# EAGLE design Weight-X (EAGLE 7.6.0)
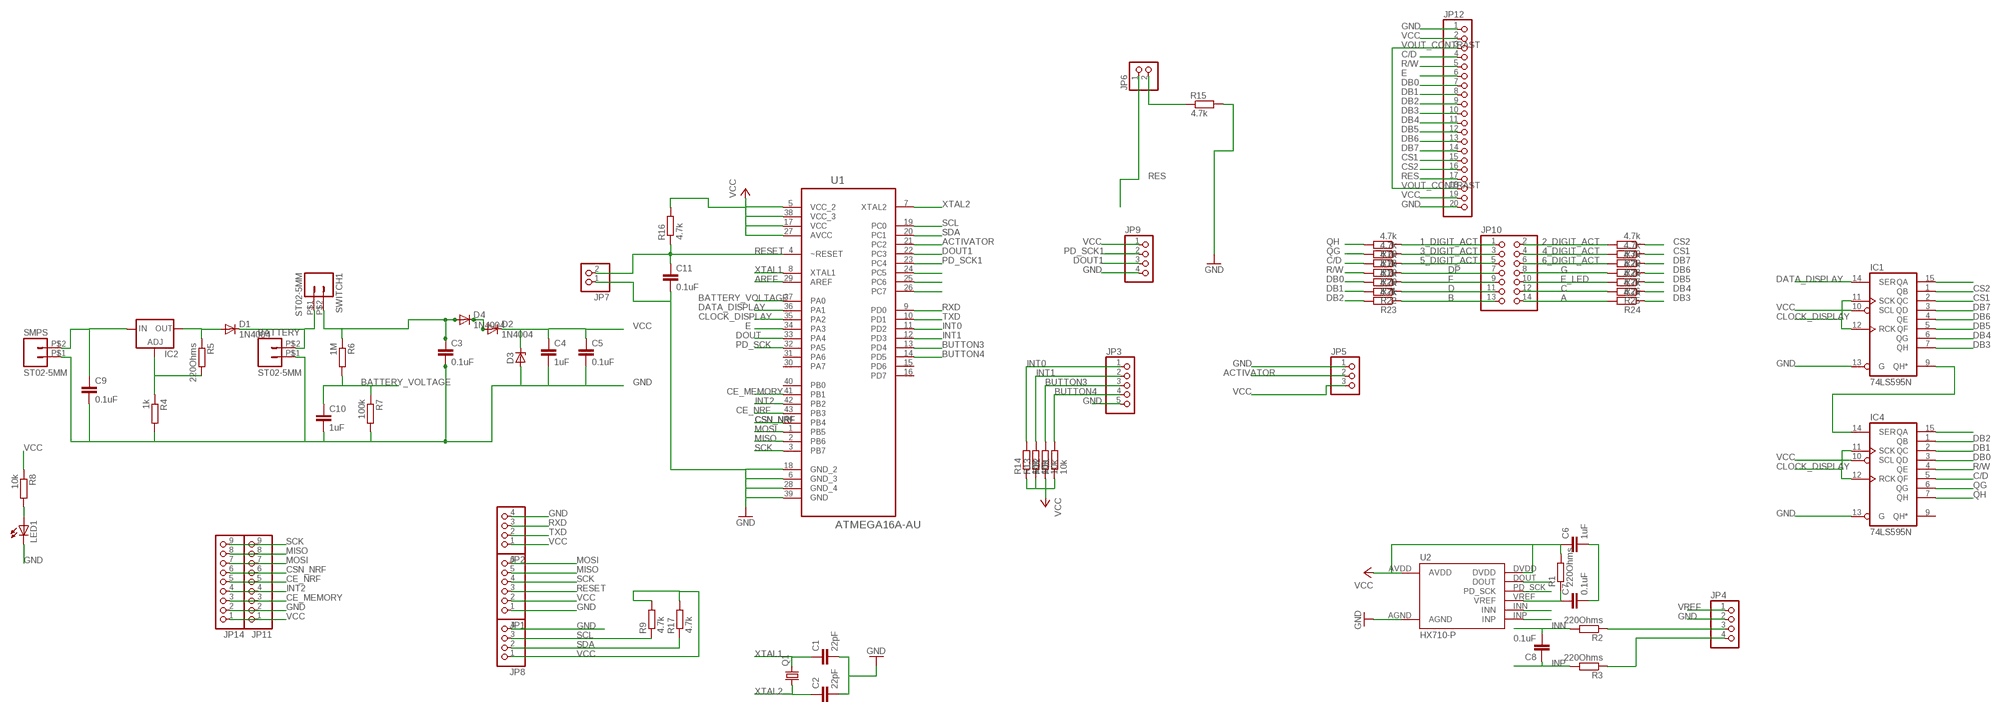
[diagram p0: schematic, sheet 1]

## Parts
BATTERY  ST02-5MM  [EK500V-02P]
C1  22pF  C2.5/2  [C2.5-2]
C2  22pF  C2.5/2  [C2.5-2]
C3  0.1uF  C5/2.5  [C5B2.5]
C4  1uF  C5/2.5  [C5B2.5]
C5  0.1uF  C5/2.5  [C5B2.5]
C6  1uF  C5/2.5  [C5B2.5]
C7  0.1uF  C5/2.5  [C5B2.5]
C8  0.1uF  C5/2.5  [C5B2.5]
C9  0.1uF  C5/2.5  [C5B2.5]
C10  1uF  C5/2.5  [C5B2.5]
C11  0.1uF  C5/2.5  [C5B2.5]
D1  1N4004  [DO41-10]
D2  1N4004  [DO41-10]
D3  ZENER-DIODEC1702-15  [C1702-15]
D4  1N4004  [DO41-10]
IC1  74LS595N  [DIL16]
IC2  LM317TS  [317TS]
IC4  74LS595N  [DIL16]
JP1  PINHD-1X6  [1X06]
JP2  PINHD-1X4  [1X04]
JP3  PINHD-1X5  [1X05]
JP4  PINHD-1X4  [1X04]
JP5  PINHD-1X3  [1X03]
JP6  PINHD-1X2  [1X02]
JP7  PINHD-1X2  [1X02]
JP8  PINHD-1X4  [1X04]
JP9  PINHD-1X4  [1X04]
JP10  PINHD-2X7  [2X07]
JP11  PINHD-1X9  [1X09]
JP12  PINHD-1X20  [1X20]
JP14  PINHD-1X9  [1X09]
LED1  LED5MM  [LED5MM]
Q1  CRYSTALHC49U-V  [HC49U-V]
R1  220Ohms  R0204/7  [0204/7]
R2  220Ohms  R0204/7  [0204/7]
R3  220Ohms  R0204/7  [0204/7]
R4  1k  R0204/7  [0204/7]
R5  220Ohms  R0204/7  [0204/7]
R6  1M  R0204/7  [0204/7]
R7  100k  R0204/7  [0204/7]
R8  10k  R0204/7  [0204/7]
R9  4.7k  R0204/7  [0204/7]
R10  4.7k  R0204/7  [0204/7]
R11  10k  R0204/7  [0204/7]
R12  10k  R0204/7  [0204/7]
R13  10k  R0204/7  [0204/7]
R14  10k  R0204/7  [0204/7]
R15  4.7k  R0204/7  [0204/7]
R16  4.7k  R0204/7  [0204/7]
R17  4.7k  R0204/7  [0204/7]
R18  4.7k  R0204/7  [0204/7]
R19  4.7k  R0204/7  [0204/7]
R20  4.7k  R0204/7  [0204/7]
R21  4.7k  R0204/7  [0204/7]
R22  4.7k  R0204/7  [0204/7]
R23  4.7k  R0204/7  [0204/7]
R24  4.7k  R0204/7  [0204/7]
R25  4.7k  R0204/7  [0204/7]
R26  4.7k  R0204/7  [0204/7]
R27  4.7k  R0204/7  [0204/7]
R28  4.7k  R0204/7  [0204/7]
R29  4.7k  R0204/7  [0204/7]
R30  4.7k  R0204/7  [0204/7]
SMPS  ST02-5MM  [EK500V-02P]
SWITCH1  ST02-5MM  [EK500V-02P]
U1  ATMEGA16A-AU  [QFP80P1200X1200X120-44N]
U2  HX710-P  [PDIP08_300MIL]

## Nets
1_DIGIT_ACT: JP10.1 R10.1
2_DIGIT_ACT: JP10.2 R30.2
3_DIGIT_ACT: JP10.3 R18.1
4_DIGIT_ACT: JP10.4 R29.2
5_DIGIT_ACT: JP10.5 R19.1
6_DIGIT_ACT: JP10.6 R28.2
A: JP10.14 R24.2
ACTIVATOR: JP5.2 U1.21(PC2)
AREF: U1.29(AREF)
B: JP10.13 R23.1
BATTERY_VOLTAGE: C10.1 R6.2 R7.1 U1.37(PA0)
BUTTON3: JP3.3 R12.2 U1.13(PD4)
BUTTON4: JP3.4 R11.2 U1.14(PD5)
C: JP10.12 R25.2
C/D: IC4.5(QF) JP12.4 R19.2
CE_MEMORY: JP11.3 JP14.3 U1.41(PB1)
CE_NRF: JP11.5 JP14.5 U1.43(PB3)
CLOCK_DISPLAY: IC1.11(SCK) IC1.12(RCK) IC4.11(SCK) IC4.12(RCK) U1.35(PA2)
CS1: IC1.2(QC) JP12.15 R29.1
CS2: IC1.1(QB) JP12.16 R30.1
CSN_NRF: JP11.6 JP14.6 U1.44(PB4)
D: JP10.11 R22.1
DATA_DISPLAY: IC1.14(SER) U1.36(PA1)
DB0: IC4.3(QD) JP12.7 R21.2
DB1: IC4.2(QC) JP12.8 R22.2
DB2: IC4.1(QB) JP12.9 R23.2
DB3: IC1.7(QH) JP12.10 R24.1
DB4: IC1.6(QG) JP12.11 R25.1
DB5: IC1.5(QF) JP12.12 R26.1
DB6: IC1.4(QE) JP12.13 R27.1
DB7: IC1.3(QD) JP12.14 R28.1
DOUT: U1.33(PA4) U2.DOUT
DOUT1: JP9.3 U1.22(PC3)
DP: JP10.7 R20.1
E: JP12.6 U1.34(PA3)
E_LED: JP10.10 R26.2
F: JP10.9 R21.1
G: JP10.8 R27.2
GND: BATTERY.P$1 C1.2 C2.2 C3.2 C4.2 C5.2 C6.2 C7.2 C9.2 C10.2 C11.2 D3.A IC1.13(G) IC4.13(G) JP1.1 JP2.4 JP3.5 JP4.2 JP5.1 JP7.1 JP8.4 JP9.4 JP11.2 JP12.1 JP12.20 JP14.2 LED1.K(C) R4.2 R7.2 R15.2 SMPS.P$1 U1.6(GND_3) U1.18(GND_2) U1.28(GND_4) U1.39(GND) U2.AGND
INN: C8.2 R2.2 U2.INN
INP: C8.1 R3.2 U2.INP
INT0: JP3.1 R14.2 U1.11(PD2)
INT1: JP3.2 R13.2 U1.12(PD3)
INT2: JP11.4 JP14.4 U1.42(PB2)
MISO: JP1.5 JP11.8 JP14.8 U1.2(PB6)
MOSI: JP1.6 JP11.7 JP14.7 U1.1(PB5)
N$1: BATTERY.P$2 D1.C SWITCH1.P$1
N$2: IC2.1(ADJ) R4.1 R5.2
N$3: LED1.A R8.2
N$4: D1.A IC2.2(OUT) R5.1
N$5: JP4.3 R2.1
N$6: D2.A D4.C
N$7: C9.1 IC2.3(IN) SMPS.P$2
N$10: C3.1 D4.A R6.1 SWITCH1.P$2
N$11: JP4.4 R3.1
N$13: JP6.2 R15.1
N$15: IC1.9(QH*) IC4.14(SER)
N$16: IC1.15(QA)
N$20: U1.24(PC5)
N$21: U1.25(PC6)
N$22: U1.26(PC7)
N$24: IC4.15(QA)
PD_SCK: U1.32(PA5) U2.PD_SCK
PD_SCK1: JP9.2 U1.23(PC4)
QG: IC4.6(QG) R18.2
QH: IC4.7(QH) R10.2
R/W: IC4.4(QE) JP12.5 R20.2
RES: JP6.1 JP12.17
RESET: C11.1 JP1.3 JP7.2 R16.1 U1.4(~RESET)
RXD: JP2.3 U1.9(PD0)
SCK: JP1.4 JP11.9 JP14.9 U1.3(PB7)
SCL: JP8.3 R9.1 U1.19(PC0)
SDA: JP8.2 R17.1 U1.20(PC1)
TXD: JP2.2 U1.10(PD1)
VCC: C4.1 C5.1 C6.1 D2.C D3.C IC1.10(SCL) IC4.10(SCL) JP1.2 JP2.1 JP5.3 JP8.1 JP9.1 JP11.1 JP12.2 JP12.19 JP14.1 R1.2 R8.1 R9.2 R11.1 R12.1 R13.1 R14.1 R16.2 R17.2 U1.5(VCC_2) U1.17(VCC) U1.27(AVCC) U1.38(VCC_3) U2.AVDD U2.DVDD
VOUT_CONTRAST: JP12.3 JP12.18
VREF: C7.1 JP4.1 R1.1 U2.VREF
XTAL1: C1.1 Q1.2 U1.8(XTAL1)
XTAL2: C2.1 Q1.1 U1.7(XTAL2)
Unconnected: IC4.9(QH*) U1.15(PD6) U1.16(PD7) U1.30(PA7) U1.31(PA6) U1.40(PB0)

## Power pins joined to a net without a drawn wire
GND: IC1.8(GND) IC4.8(GND)
VCC: IC1.16(VCC) IC4.16(VCC)

## Library data of the parts
BATTERY SMPS SWITCH1 = con-dinkle:ST02: Dinkle® Screw Terminal Block - 2 Way -5MM: EK500V series. Rated at 20A, 300VAC. Cable size: 2mm² Supplier: Altronics P2034A Source: http://www.dinkle.com/upfiles/proter21253708953.pdf -5.08MM: The back half of a EK500V4R-04P. Rated at 20A, 300VAC. Cable size: 2mm² Supplier: Altronics P2024 (half of) Source: http://www.dinkle.com/upfiles/proter21253708833.pdf -3.5MM: ED350V series. Rated at 10A, 300VAC. Cable size: 1.4mm² Supplier: Altronics P2028 Source: http://www.dinkle.com/upfiles/proter21253714491.pdf
C1-C11 = capacitor-wima:C: CAPACITOR naming: grid - package width
D1 = adafruit:1N4004: DIODE
D2 D4 = diode:1N4004: DIODE
D3 = diode:ZENER-DIODE: Z-Diode
IC1 IC4 = 74xx-us:74*595: 8-bit SHIFT REGISTER, output latch
IC2 = v-reg:LM317TS: VOLTAGE REGULATOR
JP1 = pinhead:PINHD-1X6: PIN HEADER
JP2 JP4 JP8 JP9 = pinhead:PINHD-1X4: PIN HEADER
JP3 = pinhead:PINHD-1X5: PIN HEADER
JP5 = pinhead:PINHD-1X3: PIN HEADER
JP6 JP7 = pinhead:PINHD-1X2: PIN HEADER
JP10 = pinhead:PINHD-2X7: PIN HEADER
JP11 JP14 = pinhead:PINHD-1X9: PIN HEADER
JP12 = pinhead:PINHD-1X20: PIN HEADER
LED1 = adafruit:LED: LED OSRAM: - CHIPLED LG R971, LG N971, LY N971, LG Q971, LY Q971, LO R971, LY R971 LH N974, LH R974 LS Q976, LO Q976, LY Q976 LO Q996 - Hyper CHIPLED LW Q18S LB Q993, LB Q99A, LB R99A - SideLED LS A670, LO A670, LY A670, LG A670, LP A670 LB A673, LV A673, LT A673, LW A673 LH A674 LY A675 LS A676, LA A676, LO A676, LY A676, LW A676 LS A679, LY A679, LG A679 - Hyper Micro SIDELED® LS Y876, LA Y876, LO Y876, LY Y876 LT Y87S - SmartLED LW L88C, LW L88S LB L89C, LB L89S, LG L890 LS L89K, LO L89K, LY L89K LS L896, LA L896, LO L896, LY L896 - TOPLED LS T670, LO T670, LY T670, LG T670, LP T670 LSG T670, LSP T670, LSY T670, LOP T670, LYG T670 LG T671, LOG T671, LSG T671 LB T673, LV T673, LT T673, LW T673 LH T674 LS T676, LA T676, LO T676, LY T676, LB T676, LH T676, LSB T676, LW T676 LB T67C, LV T67C, LT T67C, LS T67K, LO T67K, LY T67K, LW E67C LS E67B, LA E67B, LO E67B, LY E67B, LB E67C, LV E67C, LT E67C LW T67C LS T679, LY T679, LG T679 LS T770, LO T770, LY T770, LG T770, LP T770 LB T773, LV T773, LT T773, LW T773 LH T774 LS E675, LA E675, LY E675, LS T675 LS T776, LA T776, LO T776, LY T776, LB T776 LHGB T686 LT T68C, LB T68C - Hyper Mini TOPLED® LB M676 - Mini TOPLED Santana® LG M470 LS M47K, LO M47K, LY M47K Source: http://www.osram.convergy.de/
Q1 = adafruit:CRYSTAL: CRYSTAL; OC_FARNELL: 1666969; OC_NEWARK: unknown
R1-R30 = eagle-ltspice:R: RESISTOR, European symbol; SPICEMODEL: NONE; SPICEPREFIX: R
U1 = Atmel_By_element14_Batch_1-00:ATMEGA16A-AU: 8-bit Microcontroller; MPN: ATMEGA16A-AU; OC_FARNELL: 1704560; OC_NEWARK: 08R5490; PACKAGE: TQFP-44; SUPPLIER: Atmel
U2 = hx710:HX710*: ATMEL ATtiny 85 Packages: P = PDIP 08 30mil S = SOIC 08 EIAJ 208mil Technologies Note: for complete ordering code (temp. range, finish, tape&reel etc.) see www.atmel.com • Supply Voltage: V = (1.8…5.5)V | [blank] = (2.7…5.5)V • Speed: 10 = 10 MHz | 20 = 20 MHz Author: Dipl.-Ing. FH Rainer Bayer HHN Hochschule Heilbronn (Heilbronn University), rainer.bayer@hs-heilbronn.de Ingenieurbüro ing-rb, mail@ing-rb.de

## Net classes
0 GND: clearance 1 mm

## Board
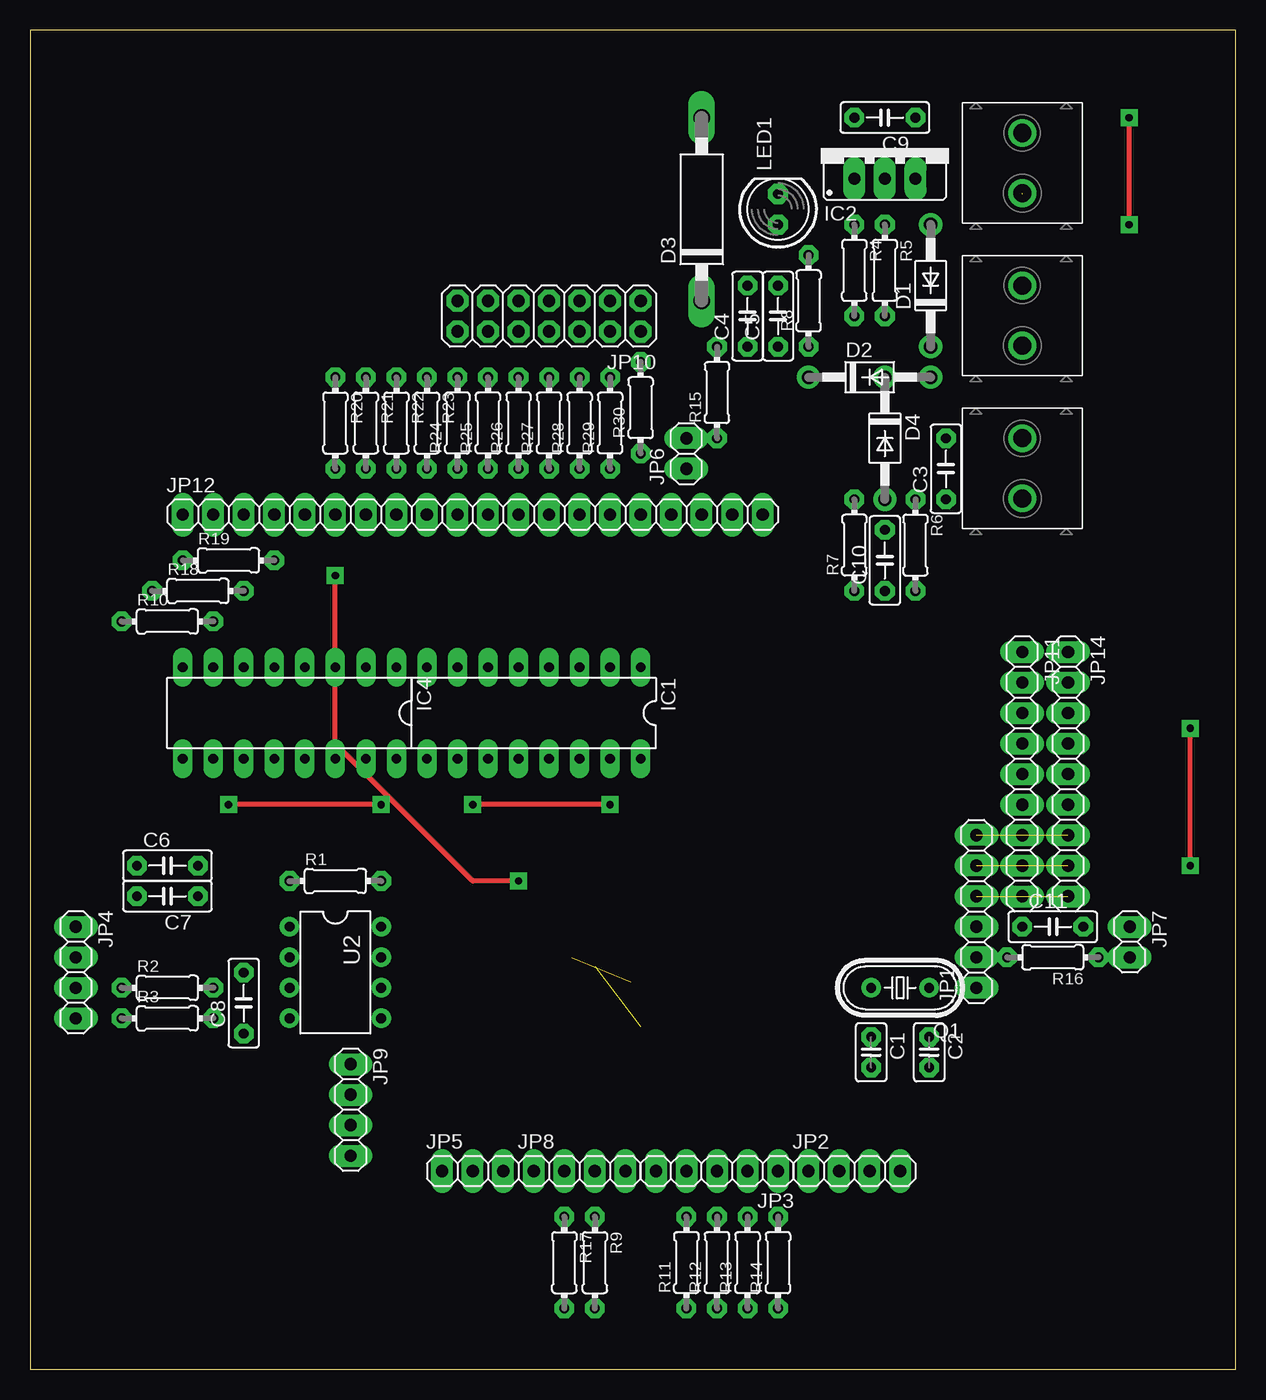
[diagram p1: board, top side]
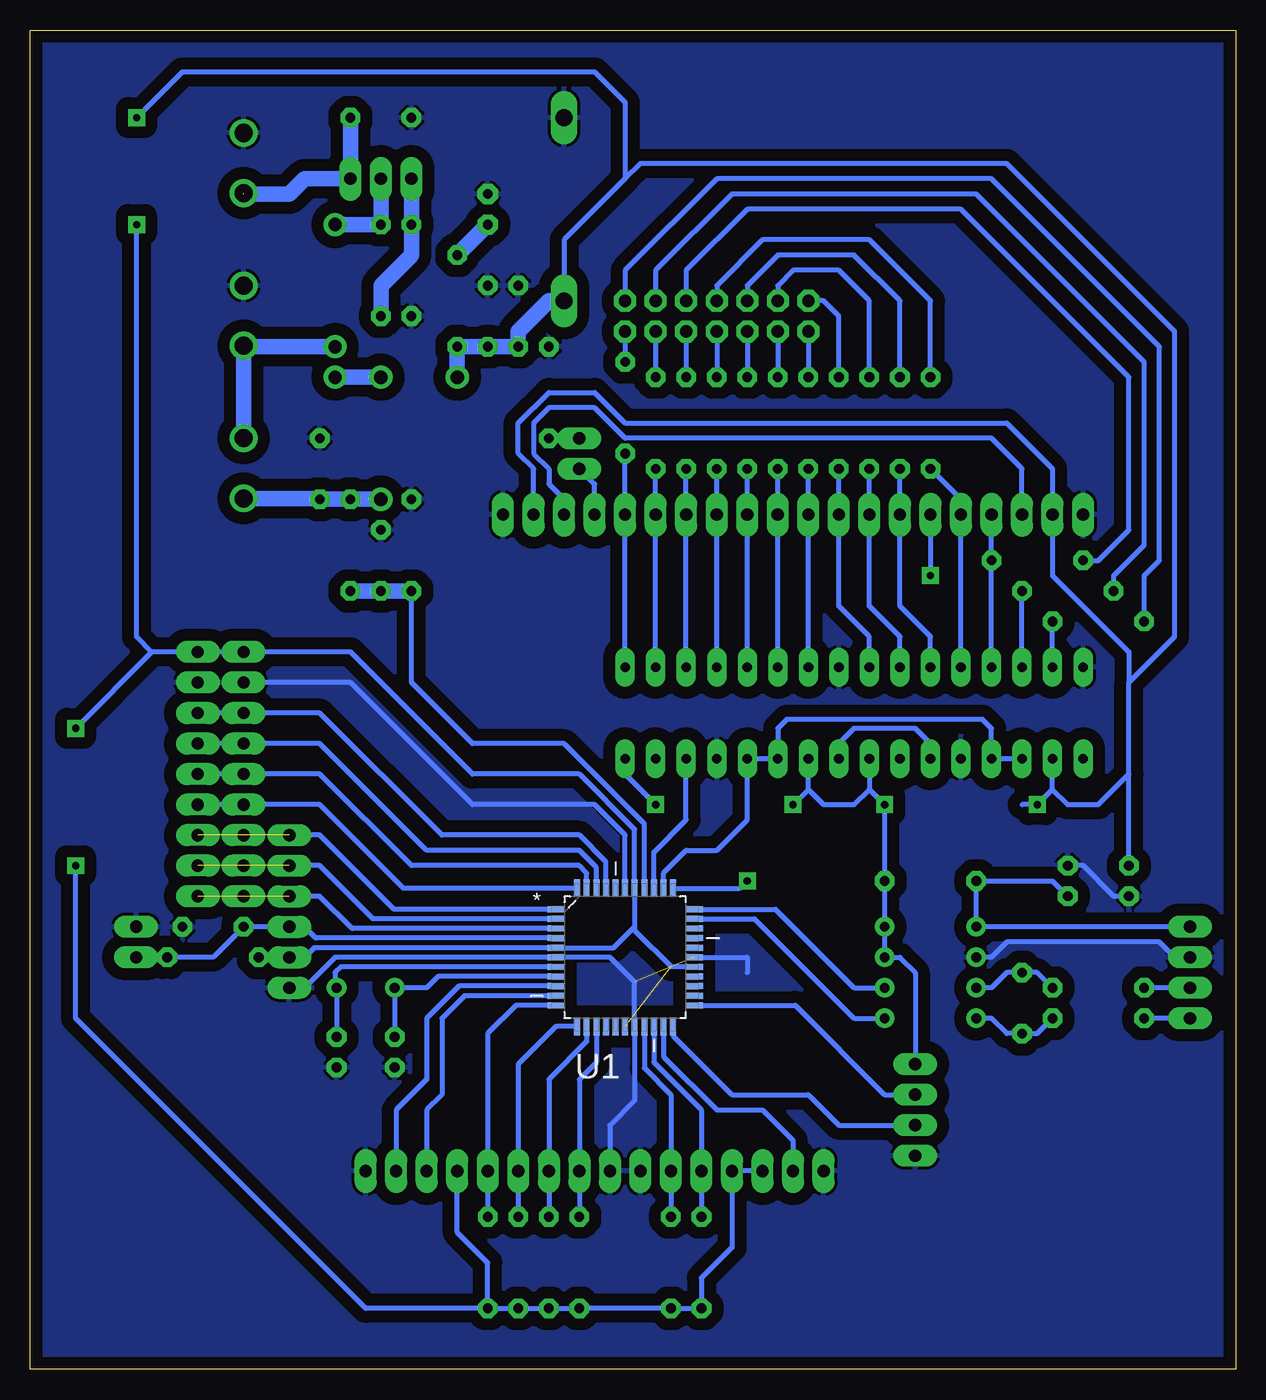
[diagram p2: board, bottom side, seen from below]

Size 100.31 x 111.43 mm. Coordinates in mm from the lower left corner, seen from the top.
Outline: 0,0 100.31,0 100.31,111.43 0,111.43 0,0
Copper layers (1*16): Top 0.035mm / dielectric 1.5mm / Bottom 0.035mm
Design rules "default *": minimum track width 10mil, minimum drill 24mil, track to track 8mil, track to pad 8mil, pad to pad 8mil, via to via 8mil, smd to smd 8mil, copper to edge 40mil, drill to drill 8mil, minimum pad ring 16mil, minimum via ring 16mil, stop-mask expansion 4mil, vias tented up to drill 0mil, thermal gap 10mil

### Footprints (pad centres in the part's own frame; a part is rotated, then mirrored left to right if it is on the bottom)
EK500V-02P = drill 1.5: P$1 0,0; P$2 5,0
C2.5-2 = drill 0.813 pad 1.6 octagon: 1 -1.27,0; 2 1.27,0
C5B2.5 = drill 0.813 pad 1.6 octagon: 1 -2.54,0; 2 2.54,0
DO41-10 = drill 1.118 pad 1.93: A 5.08,0; C -5.08,0
DO41-10' = drill 1.118: A 5.08,0; C -5.08,0
C1702-15 = drill 1.397 long: A 7.62,0; C -7.62,0
DIL16 = drill 0.813 long: 1 -8.89,-3.81; 2 -6.35,-3.81; 3 -3.81,-3.81; 4 -1.27,-3.81; 5 1.27,-3.81; 6 3.81,-3.81; 7 6.35,-3.81; 8 8.89,-3.81; 9 8.89,3.81; 10 6.35,3.81; 11 3.81,3.81; 12 1.27,3.81; 13 -1.27,3.81; 14 -3.81,3.81; 15 -6.35,3.81; 16 -8.89,3.81
317TS = drill 1.016 long: 1 -2.54,-2.54; 2 0,-2.54; 3 2.54,-2.54
1X06 = drill 1.016 long: 1 -6.35,0; 2 -3.81,0; 3 -1.27,0; 4 1.27,0; 5 3.81,0; 6 6.35,0
1X04 = drill 1.016 long: 1 -3.81,0; 2 -1.27,0; 3 1.27,0; 4 3.81,0
1X05 = drill 1.016 long: 1 -5.08,0; 2 -2.54,0; 3 0,0; 4 2.54,0; 5 5.08,0
1X03 = drill 1.016 long: 1 -2.54,0; 2 0,0; 3 2.54,0
1X02 = drill 1.016 long: 1 -1.27,0; 2 1.27,0
2X07 = drill 1.016 octagon: 1 -7.62,-1.27; 2 -7.62,1.27; 3 -5.08,-1.27; 4 -5.08,1.27; 5 -2.54,-1.27; 6 -2.54,1.27; 7 0,-1.27; 8 0,1.27; 9 2.54,-1.27; 10 2.54,1.27; 11 5.08,-1.27; 12 5.08,1.27; 13 7.62,-1.27; 14 7.62,1.27
1X09 = drill 1.016 long: 1 -10.16,0; 2 -7.62,0; 3 -5.08,0; 4 -2.54,0; 5 0,0; 6 2.54,0; 7 5.08,0; 8 7.62,0; 9 10.16,0
1X20 = drill 1.016 long: 1 -24.13,0; 2 -21.59,0; 3 -19.05,0; 4 -16.51,0; 5 -13.97,0; 6 -11.43,0; 7 -8.89,0; 8 -6.35,0; 9 -3.81,0; 10 -1.27,0; 11 1.27,0; 12 3.81,0; 13 6.35,0; 14 8.89,0; 15 11.43,0; 16 13.97,0; 17 16.51,0; 18 19.05,0; 19 21.59,0; 20 24.13,0
LED5MM = drill 0.813 pad 1.676 octagon: A -1.27,0; K 1.27,0
HC49U-V = drill 0.813: 1 -2.413,0; 2 2.413,0
0204/7 = drill 0.813 octagon: 1 -3.81,0; 2 3.81,0
QFP80P1200X1200X120-44N = smd 1.473 x 0.508: 1 -5.74,3.988; 2 -5.74,3.2; 3 -5.74,2.388; 4 -5.74,1.6; 5 -5.74,0.787; 6 -5.74,0; 7 -5.74,-0.787; 8 -5.74,-1.6; 9 -5.74,-2.388; 10 -5.74,-3.2; 11 -5.74,-3.988; 23 5.74,-3.988; 24 5.74,-3.2; 25 5.74,-2.388; 26 5.74,-1.6; 27 5.74,-0.787; 28 5.74,0; 29 5.74,0.787; 30 5.74,1.6; 31 5.74,2.388; 32 5.74,3.2; 33 5.74,3.988 | smd 0.508 x 1.473: 12 -3.988,-5.74; 13 -3.2,-5.74; 14 -2.388,-5.74; 15 -1.6,-5.74; 16 -0.787,-5.74; 17 0,-5.74; 18 0.787,-5.74; 19 1.6,-5.74; 20 2.388,-5.74; 21 3.2,-5.74; 22 3.988,-5.74; 34 3.988,5.74; 35 3.2,5.74; 36 2.388,5.74; 37 1.6,5.74; 38 0.787,5.74; 39 0,5.74; 40 -0.787,5.74; 41 -1.6,5.74; 42 -2.388,5.74; 43 -3.2,5.74; 44 -3.988,5.74
PDIP08_300MIL = drill 0.813: AGND -1.27,-3.81; AVDD -3.81,3.81; DOUT 1.27,3.81; DVDD -1.27,3.81; INN 1.27,-3.81; INP 3.81,-3.81; PD_SCK 3.81,3.81; VREF -3.81,-3.81

### Placement (x,y rotation side)
BATTERY  82.55,90.17 270 top
C1  69.98,26.39 270 top
C2  74.8,26.39 270 top
C3  76.2,74.93 90 top
C4  59.69,87.63 90 top
C5  62.23,87.63 90 top
C6  11.43,41.91 0 top
C7  11.43,39.37 180 top
C8  17.78,30.48 90 top
C9  71.12,104.14 180 top
C10  71.12,67.31 90 top
C11  85.09,36.83 0 top
D1  74.93,90.17 90 top
D2  1N4004  [DO41-10']  69.85,82.55 0 top
D3  55.88,96.52 90 top
D4  1N4004  [DO41-10']  71.12,77.47 270 top
IC1  41.91,54.61 180 top
IC2  71.12,101.6 0 top
IC4  21.59,54.61 180 top
JP1  78.74,38.1 90 top
JP2  68.58,16.51 0 top
JP3  57.15,16.51 180 top
JP4  3.81,33.02 270 top
JP5  36.83,16.51 0 top
JP6  54.61,76.2 90 top
JP7  91.49,35.56 270 top
JP8  45.72,16.51 0 top
JP9  26.67,21.59 270 top
JP10  43.18,87.63 180 top
JP11  82.55,49.53 270 top
JP12  36.83,71.12 0 top
JP14  86.36,49.53 270 top
LED1  62.23,96.52 90 top
Q1  72.39,31.75 180 top
R1  25.4,40.64 0 top
R2  11.43,31.75 0 top
R3  11.43,29.21 0 top
R4  68.58,91.44 270 top
R5  71.12,91.44 270 top
R6  73.66,68.58 270 top
R7  68.58,68.58 90 top
R8  64.77,88.9 90 top
R9  46.99,8.89 270 top
R10  11.43,62.23 0 top
R11  54.61,8.89 90 top
R12  57.15,8.89 90 top
R13  59.69,8.89 90 top
R14  62.23,8.89 90 top
R15  57.15,81.28 90 top
R16  85.09,34.29 180 top
R17  44.45,8.89 270 top
R18  13.97,64.77 0 top
R19  16.51,67.31 0 top
R20  25.4,78.74 270 top
R21  27.94,78.74 270 top
R22  30.48,78.74 270 top
R23  33.02,78.74 270 top
R24  35.56,78.74 90 top
R25  38.1,78.74 90 top
R26  40.64,78.74 90 top
R27  43.18,78.74 90 top
R28  45.72,78.74 90 top
R29  48.26,78.74 90 top
R30  50.8,80.01 90 top
SMPS  82.55,102.87 270 top
SWITCH1  82.55,77.47 270 top
U1  50.8,34.29 0 bottom
U2  25.4,33.02 270 top

### Tracks (layer width: path | path; a pad name or v marks a point on that pad's centre or on a via)
1_DIGIT_ACT
  Bottom 0.406: R10.1 7.62,66.04 6.35,67.31 6.35,85.09 20.32,99.06 43.18,99.06 50.8,91.44 JP10.1
2_DIGIT_ACT
  Bottom 0.406: JP10.2 R30.2
3_DIGIT_ACT
  Bottom 0.406: R18.1 10.16,66.04 7.62,68.58 7.62,83.82 21.59,97.79 41.91,97.79 48.26,91.44 JP10.3
4_DIGIT_ACT
  Bottom 0.406: JP10.4 R29.2
5_DIGIT_ACT
  Bottom 0.406: R19.1 11.43,67.31 8.89,69.85 8.89,82.55 22.86,96.52 40.64,96.52 45.72,91.44 JP10.5
6_DIGIT_ACT
  Bottom 0.406: JP10.6 R28.2
A
  Bottom 0.406: JP10.14 R24.2
ACTIVATOR
  Bottom 0.406: U1.21 47.6,26.01 43.18,21.59 39.37,21.59 36.83,19.05 JP5.2
B
  Bottom 0.406: R23.1 33.02,87.63 34.29,88.9 JP10.13
BATTERY_VOLTAGE
  Bottom 0.406: U1.37 49.2,45.39 55.88,52.07 63.5,52.07 68.58,57.15 R7.1
  Bottom 1.27: R7.1 C10.1 R6.2
BUTTON3
  Bottom 0.406: U1.13 54,27.28 57.15,24.13 JP3.3 R12.2
BUTTON4
  Bottom 0.406: U1.14 53.19,25.55 54.61,24.13 JP3.4 R11.2
C
  Bottom 0.406: JP10.12 R25.2
C/D
  Bottom 0.406: IC4.5 R19.2 JP12.4
CE_MEMORY
  Bottom 0.406: U1.41 52.4,42.24 54.61,44.45 66.04,44.45 76.2,54.61 JP11.3 JP14.3
CE_NRF
  Bottom 0.406: U1.43 54,41.3 54.61,41.91 68.58,41.91 76.2,49.53 JP11.5 JP14.5
CLOCK_DISPLAY
  Bottom 0.406: IC4.11 IC4.12 20.32,53.34 20.33,53.34 21.08,54.09 37.35,54.09 38.1,53.34 IC1.11 IC1.12 40.64,45.72 43.18,43.18 45.72,43.18 47.6,41.3 U1.35
CS1
  Bottom 0.406: R29.1 JP12.15 IC1.2
CS2
  Bottom 0.406: R30.1 JP12.16 IC1.1
CSN_NRF
  Bottom 0.406: U1.44 69.24,40.03 76.2,46.99 JP11.6 JP14.6
D
  Bottom 0.406: R22.1 30.48,88.9 33.02,91.44 36.83,91.44 38.1,90.17 JP10.11
DATA_DISPLAY
  Bottom 0.406: U1.36 48.41,43.03 45.72,45.72 IC1.14
DB0
  Bottom 0.406: R21.2 JP12.7 27.94,63.5 25.4,60.96 IC4.3
DB1
  Bottom 0.406: R22.2 JP12.8 30.48,63.5 27.94,60.96 IC4.2
DB2
  Bottom 0.406: R23.2 JP12.9 33.02,63.5 30.48,60.96 IC4.1
DB3
  Bottom 0.406: R24.1 JP12.10 IC1.7
DB4
  Bottom 0.406: R25.1 JP12.11 IC1.6
DB5
  Bottom 0.406: R26.1 JP12.12 IC1.5
DB6
  Bottom 0.406: R27.1 JP12.13 IC1.4
DB7
  Bottom 0.406: R28.1 JP12.14 IC1.3
DOUT
  Bottom 0.406: U1.33 38.28,38.28 31.75,31.75 U2.DOUT
DOUT1
  Bottom 0.406: U1.22 46.81,27.76 41.91,22.86 35.56,22.86 33.02,20.32 JP9.3
DP
  Bottom 0.406: R20.1 25.4,88.9 30.48,93.98 39.37,93.98 43.18,90.17 JP10.7
E  (via drill 0.6)
  Top 0.406: v40.64,40.64 36.83,40.64 25.4,52.07 v25.4,66.04
  Bottom 0.406: U1.34 41.25,40.03 v40.64,40.64 | JP12.6 v25.4,66.04
E_LED
  Bottom 0.406: JP10.10 R26.2
F
  Bottom 0.406: R21.1 27.94,88.9 31.75,92.71 38.1,92.71 40.64,90.17 JP10.9
G
  Bottom 0.406: JP10.8 R27.2
GND  (1 unrouted)
  Bottom 0.406: JP3.5 52.07,20.32 50.01,22.38 U1.18 50.01,32.23 52.07,34.29 U1.6 74.93,34.29 77.47,31.75 JP1.1 | U1.39 50.8,44.45 53.34,46.99 63.5,46.99 73.66,57.15 JP11.2 | JP4.2 5.08,34.29 6.35,35.56 19.05,35.56 20.32,34.29 U2.AGND | U1.28 40.64,34.29 40.64,33.02 | C7.2 10.16,39.37 12.7,41.91 C6.2
  pour Bottom: 0,111.76 100.33,111.76 100.33,0 0,0
INN
  Bottom 0.406: U2.INN 20.32,31.75 19.05,33.02 C8.2 16.51,33.02 R2.2
INP
  Bottom 0.406: U2.INP 20.32,29.21 19.05,27.94 C8.1 16.51,27.94 R3.2
INT0
  Bottom 0.406: U1.11 59.87,30.3 62.23,27.94 JP3.1 R14.2
INT1
  Bottom 0.406: U1.12 56.54,28.55 59.69,25.4 JP3.2 R13.2
INT2
  Bottom 0.406: U1.42 53.19,41.76 54.61,43.18 67.31,43.18 76.2,52.07 JP11.4 JP14.4
MISO  (2 unrouted)
  Bottom 0.406: U1.2 71.78,37.49 76.2,41.91 JP1.5
MOSI  (2 unrouted)
  Bottom 0.406: U1.1 70.03,38.28 76.2,44.45 JP1.6
N$1
  Bottom 1.27: D1.C 82.47,85.09 BATTERY.P$2 SWITCH1.P$1
N$2
  Bottom 1.27: IC2.1 R4.1 68.58,92.71 71.12,90.17 R5.2
N$3
  Bottom 1.27: LED1.A R8.2
N$4
  Bottom 1.27: IC2.2 R5.1 D1.A
N$5
  Bottom 0.406: JP4.3 R2.1
N$6
  Bottom 1.27: D2.A D4.C
N$7  (1 unrouted)
  Bottom 1.27: C9.1 IC2.3 77.47,99.06 78.74,97.79 82.55,97.79
N$10
  Bottom 1.27: SWITCH1.P$2 76.28,72.47 C3.1 R6.1 D4.A
N$11
  Bottom 0.406: JP4.4 R3.1
N$13
  Bottom 0.406: JP6.2 R15.1
N$15
  Bottom 0.406: IC4.14 25.4,52.07 26.67,53.34 31.75,53.34 33.02,52.07 IC1.9
PD_SCK
  Bottom 0.406: U1.32 40.03,37.49 31.75,29.21 U2.PD_SCK
PD_SCK1
  Bottom 0.406: U1.23 36.65,30.3 29.21,22.86 JP9.2
QG
  Bottom 0.406: IC4.6 R18.2
QH
  Bottom 0.406: IC4.7 R10.2
R/W
  Bottom 0.406: R20.2 22.86,72.39 JP12.5 IC4.4
RES
  Bottom 0.406: JP12.17 53.34,73.66 JP6.1
RESET
  Bottom 0.406: U1.4 76.53,35.89 77.47,36.83 JP1.3 C11.1 85.09,34.29 R16.1 JP7.2
RXD
  Bottom 0.406: U1.9 64.62,31.9 67.31,29.21 67.31,24.13 69.85,21.59 JP2.3
SCK  (2 unrouted)
  Bottom 0.406: U1.3 73.51,36.68 76.2,39.37 JP1.4
SCL
  Bottom 0.406: U1.19 49.2,25.07 46.99,22.86 JP8.3 R9.1
SDA
  Bottom 0.406: U1.20 48.41,25.55 44.45,21.59 JP8.2 R17.1
TXD
  Bottom 0.406: U1.10 64.16,31.09 66.04,29.21 66.04,22.86 67.31,21.59 JP2.2
VCC  (via drill 0.6)  (1 unrouted)
  Top 0.406: v48.26,46.99 v36.83,46.99 | v29.21,46.99 v16.51,46.99 | v96.52,41.91 v96.52,53.34 | v91.44,95.25 v91.44,104.14
  Bottom 0.406: JP5.3 JP8.1 41.91,10.16 44.45,7.62 R17.2 R9.2 R11.1 R12.1 R13.1 R14.1 | 8.89,57.15 8.89,59.69 15.24,66.04 JP12.2 15.24,74.93 19.05,78.74 50.8,78.74 53.34,81.28 57.15,81.28 59.69,78.74 59.69,76.2 58.42,74.93 JP12.19 | 15.24,48.26 IC4.10 | 35.56,48.26 IC1.10 | IC4.16 30.48,48.26 | R14.1 62.23,8.89 64.77,11.43 JP2.1 | R16.2 JP1.2 77.47,34.29 76.68,35.08 U1.5 51.77,35.08 50.01,36.83 | 90.17,59.69 JP14.1 JP11.1 73.66,59.69 63.5,49.53 54.61,49.53 50.01,44.93 U1.38 50.01,36.83 | 90.17,59.69 91.44,60.96 v91.44,95.25 | v91.44,104.14 87.63,107.95 53.34,107.95 50.8,105.41 50.8,99.06 | 50.8,99.06 55.88,93.98 D3.C | R1.2 U2.AVDD U2.DVDD | 50.01,36.83 50.01,36.54 46.98,33.51 45.07,33.51 U1.27 | R14.1 72.39,5.08 96.52,29.21 v96.52,41.91 | v96.52,53.34 90.17,59.69 | IC1.16 50.8,49.53 v48.26,46.99 | 17.78,46.99 v16.51,46.99 15.24,48.26 | R1.2 U2.DVDD | v36.83,46.99 35.56,48.26 | 35.56,48.26 34.29,46.99 31.75,46.99 30.48,48.26 | 30.48,48.26 v29.21,46.99 R1.2 | 15.24,48.26 13.97,46.99 11.43,46.99 8.89,49.53 | 8.89,49.53 8.89,57.15 | 8.89,57.15 5.08,60.96 5.08,86.36 19.05,100.33 49.53,100.33 50.8,99.06 | C6.1 8.89,49.53 | U2.DVDD 27.94,34.29 26.67,33.02 JP9.1
  Bottom 1.27: D3.C 57.15,88.9 59.69,86.36 C4.1 C5.1 R8.1 D2.C
VOUT_CONTRAST
  Bottom 0.406: JP12.3 17.78,74.93 20.32,77.47 50.8,77.47 53.34,80.01 57.15,80.01 58.42,78.74 58.42,76.2 57.15,74.93 57.15,73.66 55.88,72.39 JP12.18
VREF
  Bottom 0.406: JP4.1 U2.VREF R1.1 15.24,40.64 C7.1
XTAL1
  Bottom 0.406: U1.8 66.37,32.69 67.31,31.75 Q1.2 C1.1
XTAL2
  Bottom 0.406: U1.7 74.45,33.5 74.93,33.02 74.93,31.88 Q1.1 C2.1